# EAGLE design Trail-Traffic-Counter-Board-v10 (EAGLE 8.0.0)

## Sheet 1 of 2
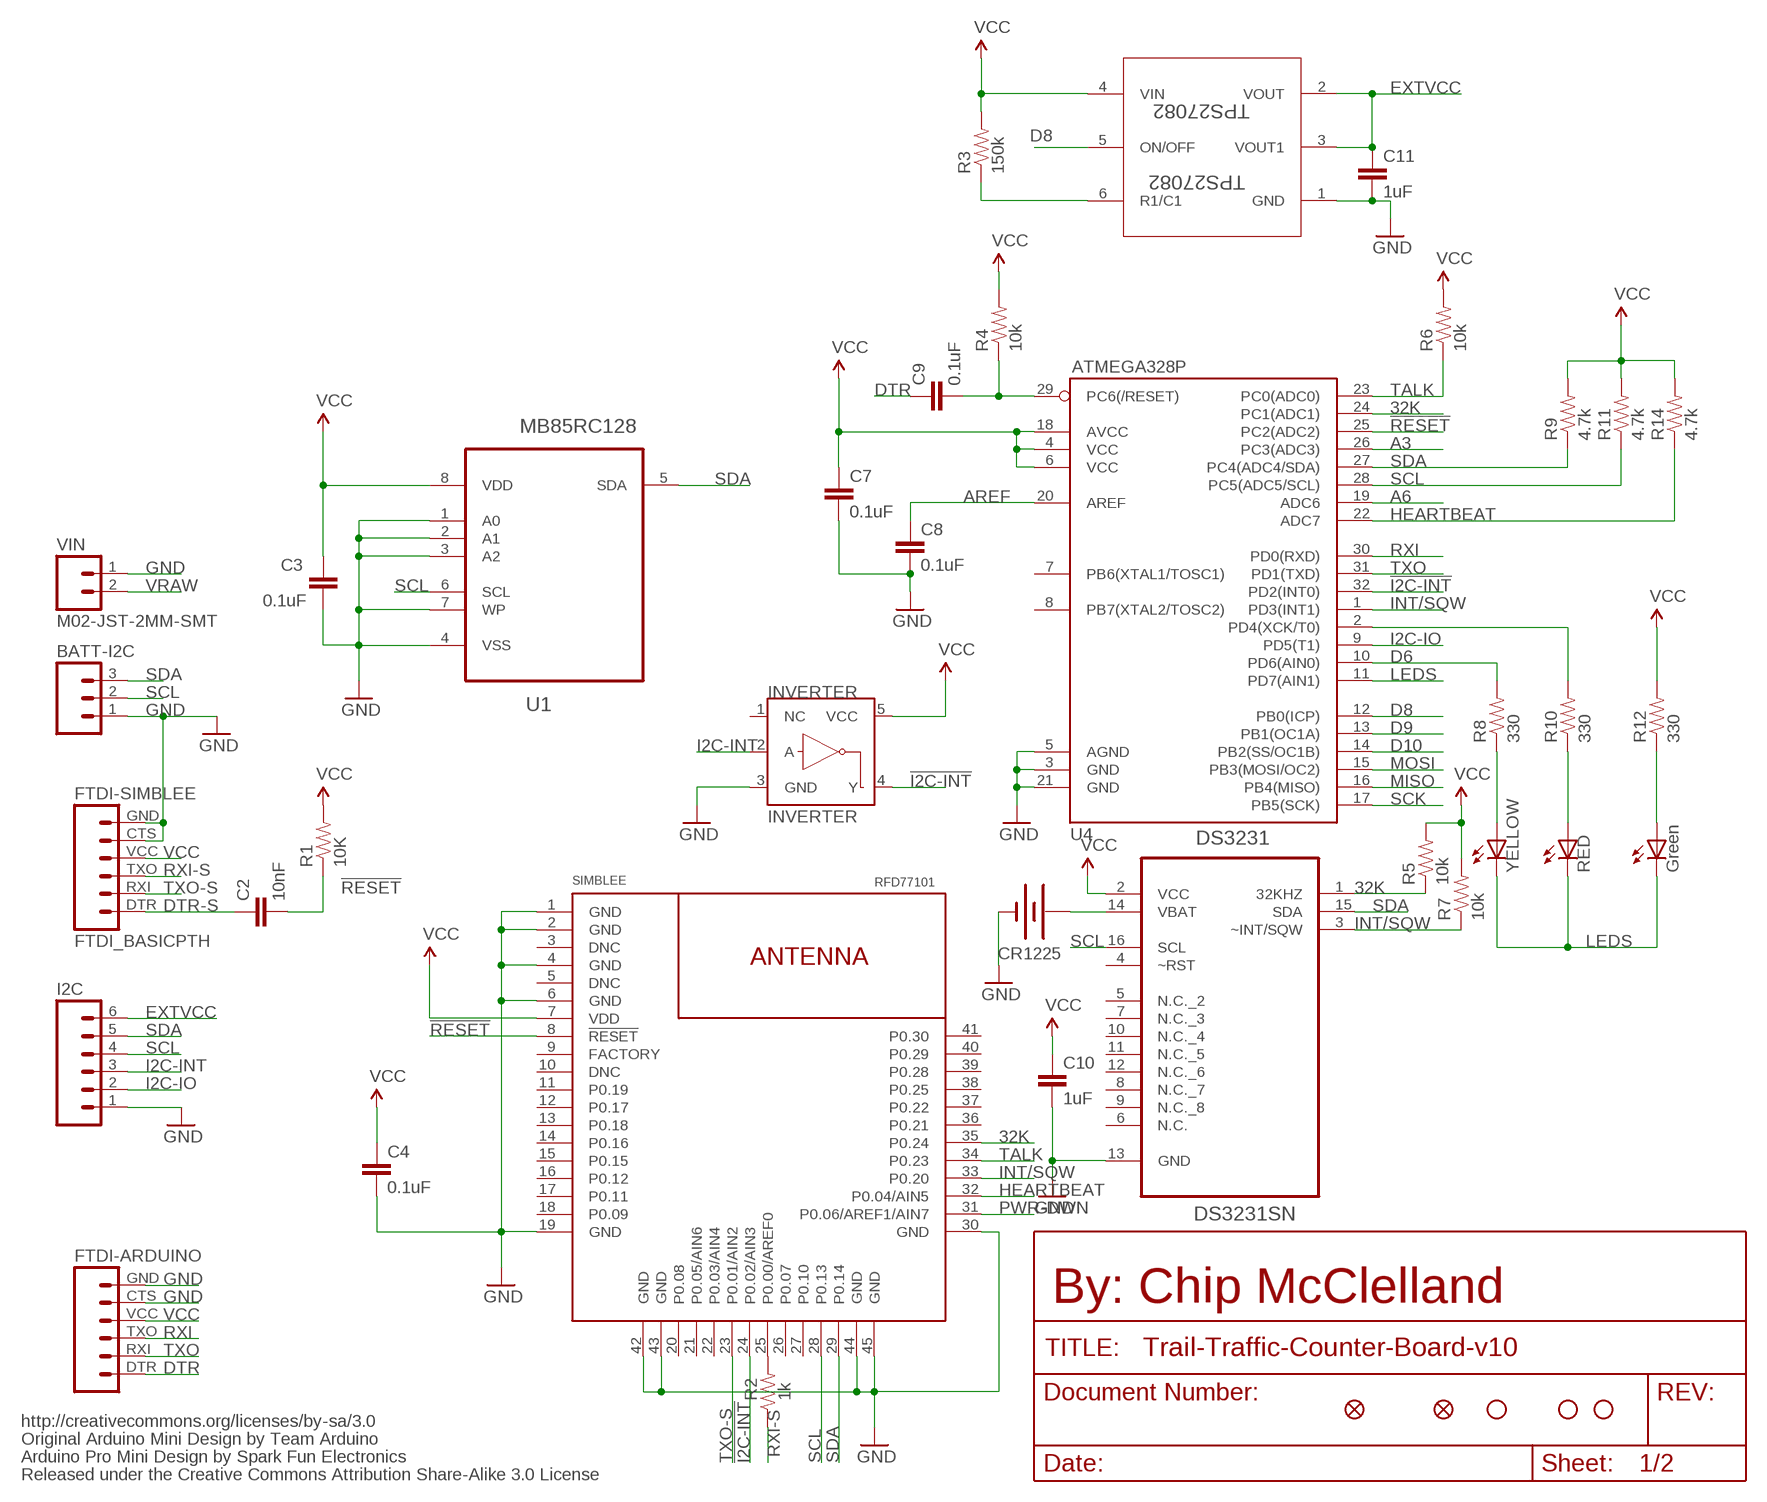
[diagram p0: schematic, sheet 1]

### Parts
ATMEGA328P  U4  ATMEGA168  [TQFP32-08]
BATT-I2C  M03LOCK  [1X03_LOCK]
C2  10nF  CAP0805  [0805]
C3  0.1uF  CAP0805  [0805]
C4  0.1uF  CAP0805  [0805]
C7  0.1uF  CAP0805  [0805]
C8  0.1uF  CAP0805  [0805]
C9  0.1uF  CAP0805  [0805]
C10  1uF  CAP0805  [0805]
C11  1uF  CAP0805  [0805]
CR1225  BATTERY12MM  [BATTCON_12MM]
DS3231  DS3231SN  [SOIC127P1032X265-16N]
FID1  FIDUCIALUFIDUCIAL  [MICRO-FIDUCIAL]
FID2  FIDUCIALUFIDUCIAL  [MICRO-FIDUCIAL]
FTDI-ARDUINO  FTDI Basic  FTDI_BASICPTH  [FTDI_BASIC]
FTDI-SIMBLEE  FTDI_BASICPTH  [FTDI_BASIC]
I2C  M06LOCK  [1X06_LOCK]
INVERTER  INVERTER  [SOT23-5]
JP6  STAND-OFF  [STAND-OFF]
JP7  STAND-OFF  [STAND-OFF]
JP8  STAND-OFF  [STAND-OFF]
LED1  YELLOW  LEDCHIPLED_0805  [CHIPLED_0805]
LED2  RED  LEDCHIPLED_0805  [CHIPLED_0805]
MB85RC128  U1  MB85RC128PNF-G-JNE1  [SOIC127P600X175-8N]
PWR  Green  LEDCHIPLED_0805  [CHIPLED_0805]
R1  10K  RESISTOR0805-RES  [0805]
R2  1k  RESISTOR0805-RES  [0805]
R3  150k  RESISTOR0805-RES  [0805]
R4  10k  RESISTOR0805-RES  [0805]
R5  10k  RESISTOR0805-RES  [0805]
R6  10k  RESISTOR0805-RES  [0805]
R7  10k  RESISTOR0805-RES  [0805]
R8  330  RESISTOR0603  [0603-RES]
R9  4.7k  RESISTOR0805-RES  [0805]
R10  330  RESISTOR0603  [0603-RES]
R11  4.7k  RESISTOR0805-RES  [0805]
R12  330  RESISTOR0603  [0603-RES]
R14  4.7k  RESISTOR0805-RES  [0805]
SIMBLEE  RFD77101  [RFD77101]
TPS27082  TPS27082  [TSOT-23]
VIN  M02-JST-2MM-SMT  [JST-2-SMD]

### Nets
32K: ATMEGA328P.24(PC1(ADC1)) DS3231.1(32KHZ) R5.1 SIMBLEE.35(P0.24)
!I2C-INT: ATMEGA328P.32(PD2(INT0)) INVERTER.4(Y) SIMBLEE.24(P0.02/AIN3)
!RESET: ATMEGA328P.25(PC2(ADC2)) C2.2 R1.1 SIMBLEE.8(!RESET!)
A3: ATMEGA328P.26(PC3(ADC3))
A6: ATMEGA328P.19(ADC6)
AREF: ATMEGA328P.20(AREF) C8.1
D6: ATMEGA328P.10(PD6(AIN0)) R8.2
D8: ATMEGA328P.12(PB0(ICP)) TPS27082.5(ON/OFF)
D9: ATMEGA328P.13(PB1(OC1A))
D10: ATMEGA328P.14(PB2(SS/OC1B))
DTR: C9.1 FTDI-ARDUINO.DTR
DTR-S: C2.1 FTDI-SIMBLEE.DTR
EXTVCC: C11.1 I2C.6 TPS27082.2(VOUT) TPS27082.3(VOUT1)
GND: ATMEGA328P.3(GND) ATMEGA328P.5(AGND) ATMEGA328P.21(GND) BATT-I2C.1 C3.2 C4.2 C7.2 C8.2 C10.2 C11.2 CR1225.GND(-) DS3231.13(GND) FTDI-ARDUINO.CTS FTDI-ARDUINO.GND FTDI-SIMBLEE.CTS FTDI-SIMBLEE.GND I2C.1 INVERTER.3(GND) MB85RC128.1(A0) MB85RC128.2(A1) MB85RC128.3(A2) MB85RC128.4(VSS) MB85RC128.7(WP) SIMBLEE.1(GND) SIMBLEE.2(GND) SIMBLEE.4(GND) SIMBLEE.6(GND) SIMBLEE.19(GND) SIMBLEE.30(GND) SIMBLEE.42(GND) SIMBLEE.43(GND) SIMBLEE.44(GND) SIMBLEE.45(GND) TPS27082.1(GND) VIN.1 ; also sheet 2
HEARTBEAT: ATMEGA328P.22(ADC7) R14.1 SIMBLEE.32(P0.04/AIN5)
I2C-INT: I2C.3 INVERTER.2(A)
I2C-IO: ATMEGA328P.9(PD5(T1)) I2C.2
INT/SQW: ATMEGA328P.1(PD3(INT1)) DS3231.3(~INT/SQW) R7.1 SIMBLEE.33(P0.20)
LEDS: ATMEGA328P.11(PD7(AIN1)) LED1.C LED2.C PWR.C
MISO: ATMEGA328P.16(PB4(MISO))
MOSI: ATMEGA328P.15(PB3(MOSI/OC2))
N$1: LED1.A R8.1
N$3: ATMEGA328P.2(PD4(XCK/T0)) R10.2
N$4: LED2.A R10.1
N$5: R3.1 TPS27082.6(R1/C1)
N$17: R2.2 SIMBLEE.25(P0.00/AREF0)
N$38: PWR.A R12.1
PWR-DWN: SIMBLEE.31(P0.06/AREF1/AIN7) ; also sheet 2
RESET: ATMEGA328P.29(PC6(/RESET)) C9.2 R4.1
RXI: ATMEGA328P.30(PD0(RXD)) FTDI-ARDUINO.TXO
RXI-S: FTDI-SIMBLEE.TXO R2.1
SCK: ATMEGA328P.17(PB5(SCK))
SCL: ATMEGA328P.28(PC5(ADC5/SCL)) BATT-I2C.2 DS3231.16(SCL) I2C.4 MB85RC128.6(SCL) R11.1 SIMBLEE.28(P0.13)
SDA: ATMEGA328P.27(PC4(ADC4/SDA)) BATT-I2C.3 DS3231.15(SDA) I2C.5 MB85RC128.5(SDA) R9.1 SIMBLEE.29(P0.14)
TALK: ATMEGA328P.23(PC0(ADC0)) R6.1 SIMBLEE.34(P0.23)
TXO: ATMEGA328P.31(PD1(TXD)) FTDI-ARDUINO.RXI
TXO-S: FTDI-SIMBLEE.RXI SIMBLEE.23(P0.01/AIN2)
VBAT: CR1225.PWR@1(+) DS3231.14(VBAT)
VCC: ATMEGA328P.4(VCC) ATMEGA328P.6(VCC) ATMEGA328P.18(AVCC) C3.1 C4.1 C7.1 C10.1 DS3231.2(VCC) FTDI-ARDUINO.VCC FTDI-SIMBLEE.VCC INVERTER.5(VCC) MB85RC128.8(VDD) R1.2 R3.2 R4.2 R5.2 R6.2 R7.2 R9.2 R11.2 R12.2 R14.2 SIMBLEE.7(VDD) TPS27082.4(VIN) ; also sheet 2
VRAW: VIN.2 ; also sheet 2
Unconnected: ATMEGA328P.7(PB6(XTAL1/TOSC1)) ATMEGA328P.8(PB7(XTAL2/TOSC2)) DS3231.4(~RST) DS3231.5(N.C._2) DS3231.6(N.C.) DS3231.7(N.C._3) DS3231.8(N.C._7) DS3231.9(N.C._8) DS3231.10(N.C._4) DS3231.11(N.C._5) DS3231.12(N.C._6) INVERTER.1(NC) SIMBLEE.3(DNC) SIMBLEE.5(DNC) SIMBLEE.9(FACTORY) SIMBLEE.10(DNC) SIMBLEE.11(P0.19) SIMBLEE.12(P0.17) SIMBLEE.13(P0.18) SIMBLEE.14(P0.16) SIMBLEE.15(P0.15) SIMBLEE.16(P0.12) SIMBLEE.17(P0.11) SIMBLEE.18(P0.09) SIMBLEE.20(P0.08) SIMBLEE.21(P0.05/AIN6) SIMBLEE.22(P0.03/AIN4) SIMBLEE.26(P0.07) SIMBLEE.27(P0.10) SIMBLEE.36(P0.21) SIMBLEE.37(P0.22) SIMBLEE.38(P0.25) SIMBLEE.39(P0.28) SIMBLEE.40(P0.29) SIMBLEE.41(P0.30)

### Notes on the sheet
- By: Chip McClelland
- http://creativecommons.org/licenses/by-sa/3.0
- Original Arduino Mini Design by Team Arduino
- Arduino Pro Mini Design by Spark Fun Electronics
- Released under the Creative Commons Attribution Share-Alike 3.0 License

## Sheet 2 of 2
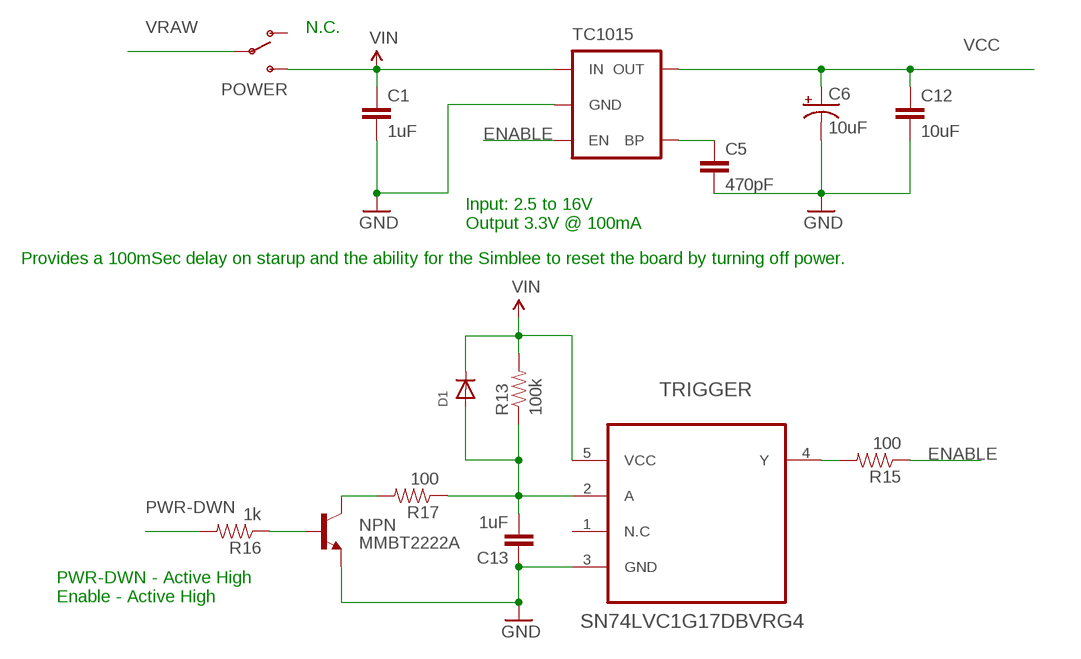
[diagram p1: schematic, sheet 2]

### Parts
C1  1uF  CAP0805  [0805]
C5  470pF  CAP0805  [0805]
C6  10uF  CAP_POL1206  [EIA3216]
C12  10uF  CAP0805  [0805]
C13  1uF  CAP0805  [0805]
D1  DIODESOD-523  [SOD-523]
NPN  MMBT2222A  TRANSISTOR_NPNMMBT2222A  [SOT23-3]
POWER  SWITCH-SPDTPTH  [SWITCH-SPDT]
R13  100k  RESISTOR0805-RES  [0805]
R15  100  RESISTOR0805-RES  [0805]
R16  1k  RESISTOR0805-RES  [0805]
R17  100  RESISTOR0805-RES  [0805]
TC1015  MIC52053.3V  [SOT23-5]
TRIGGER  SN74LVC1G17DBVRG4  [SOT95P280X145-5N]

### Nets
ENABLE: R15.1 TC1015.3(EN)
GND: C1.2 C5.2 C6.C(-) C12.2 C13.1 NPN.2(E) TC1015.2(GND) TRIGGER.3(GND) ; also sheet 1
N$2: C5.1 TC1015.4(BP)
N$6: C13.2 D1.A R13.1 R17.1 TRIGGER.2(A)
N$14: R15.2 TRIGGER.4(Y)
N$15: NPN.1(B) R16.1
N$16: NPN.3(C) R17.2
PWR-DWN: R16.2 ; also sheet 1
VCC: C6.A(+) C12.1 TC1015.5(OUT) ; also sheet 1
VIN: C1.1 D1.K(C) POWER.3(S) R13.2 TC1015.1(IN) TRIGGER.5(VCC)
VRAW: POWER.2(P) ; also sheet 1
Unconnected: POWER.1(O) TRIGGER.1(N.C)

### Notes on the sheet
- N.C.
- Input: 2.5 to 16V
  Output 3.3V @ 100mA
- Provides a 100mSec delay on starup and the ability for the Simblee to reset the board by turning off power.
- PWR-DWN - Active High
  Enable - Active High

## Library data of the parts
ATMEGA328P = SparkFun:ATMEGA168
BATT-I2C = SparkFun-Connectors:M03: Header 3 Standard 3-pin 0.1" header. Use with straight break away headers (SKU : PRT-00116), right angle break away headers (PRT-00553), swiss pins (PRT-00743), machine pins (PRT-00117), and female headers (PRT-00115). Molex polarized connector foot print use with SKU : PRT-08232 with associated crimp pins and housings.
C1 C2 C5 C12 = SparkFun-Passives:CAP: Capacitor Standard 0603 ceramic capacitor, and 0.1" leaded capacitor.
C3 C4 C7-C11 C13 = SparkFun-Capacitors:CAP: Capacitor Standard 0603 ceramic capacitor, and 0.1" leaded capacitor.
C6 = SparkFun-Capacitors:CAP_POL: Capacitor Polarized These are standard SMD and PTH capacitors. Normally 10uF, 47uF, and 100uF in electrolytic and tantalum varieties. Always verify the external diameter of the through hole cap, it varies with capacity, voltage, and manufacturer. The EIA devices should be standard.
CR1225 = SparkFun-Electromechanical:BATTERY: Battery Holders Various common sizes : AA, AAA, 20mm coin cell and 12mm coin cell. 20MM_4LEGS, BATT-10373
D1 = adafruit:DIODE: Diode SMADIODE - SMA Surface Mount Package 20V 1A Schottky Diode Digikey: 641-1014-6-ND DO-1N4148 - Through Hole Small Current Diode SOD-123 20V 1 A (.5mV Vf) Schottky Diode - Digikey: MBRX120TPMSCT-ND SOD-323 10V 570mA (.38mV Vf, 3ns) Schottky Diode - Digikey: ZLLS410CT-ND SOD-523 30V 30mA Schottky Diode (RB751S-40TE61) - Digikey: RB751S-40TE61CT-ND SOT23-R/W - SOT23 Package (R = Solder Paste/Reflow Ovens, W = Hand-Soldering) BAT54Film 40V 300mA - Digikey: 497-7162-1-ND
DS3231 = Maxim_By_element14_Batch_1:DS3231SN: Extremely Accurate I2C-Integrated RTC/TCXO/Crystal; MPN: DS3231SN#; OC_FARNELL: 1593292; OC_NEWARK: 68K3406; PACKAGE: SOIC-16; SUPPLIER: Maxim
FID1 FID2 = SparkFun-Aesthetics:FIDUCIAL: Fiducial Alignment Points Various fiducial points for machine vision alignment.
FTDI-ARDUINO FTDI-SIMBLEE = SparkFun-Connectors:FTDI_BASIC: FTDI Basic header with labels
I2C = SparkFun-Connectors:M06: Header 6 Standard 6-pin 0.1" header. Use with straight break away headers (SKU : PRT-00116), right angle break away headers (PRT-00553), swiss pins (PRT-00743), machine pins (PRT-00117), and female headers (PRT-00115). Molex polarized connector foot print use with SKU : PRT-08094 with associated crimp pins and housings. NOTES ON THE VARIANTS LOCK and LOCK_LONGPADS... This footprint was designed to help hold the alignment of a through-hole component (i.e. 6-pin header) while soldering it into place. You may notice that each hole has been shifted either up or down by 0.005 of an inch from it's more standard position (which is a perfectly straight line). This slight alteration caused the pins (the squares in the middle) to touch the edges of the holes. Because they are alternating, it causes a "brace" to hold the component in place. 0.005 has proven to be the perfect amount of "off-center" position when using our standard breakaway headers. Although looks a little odd when you look at the bare footprint, once you have a header in there, the alteration is very hard to notice. Also,if you push a header all the way into place, it is covered up entirely on the bottom side. This idea of altering the position of holes to aid alignment will be further integrated into the Sparkfun Library for other footprints. It can help hold any component with 3 or more connection pins.
INVERTER = SparkFun-DigitalIC:INVERTER: Single inverter, SOT23-5
JP6-JP8 = SparkFun:STAND-OFF: Stand Off This is the mechanical footprint for a #4 phillips button head screw. Use the keepout ring to avoid running the screw head into surrounding components. SKU : PRT-00447
LED1 LED2 PWR = adafruit:LED: LED OSRAM: - CHIPLED LG R971, LG N971, LY N971, LG Q971, LY Q971, LO R971, LY R971 LH N974, LH R974 LS Q976, LO Q976, LY Q976 LO Q996 - Hyper CHIPLED LW Q18S LB Q993, LB Q99A, LB R99A - SideLED LS A670, LO A670, LY A670, LG A670, LP A670 LB A673, LV A673, LT A673, LW A673 LH A674 LY A675 LS A676, LA A676, LO A676, LY A676, LW A676 LS A679, LY A679, LG A679 - Hyper Micro SIDELED® LS Y876, LA Y876, LO Y876, LY Y876 LT Y87S - SmartLED LW L88C, LW L88S LB L89C, LB L89S, LG L890 LS L89K, LO L89K, LY L89K LS L896, LA L896, LO L896, LY L896 - TOPLED LS T670, LO T670, LY T670, LG T670, LP T670 LSG T670, LSP T670, LSY T670, LOP T670, LYG T670 LG T671, LOG T671, LSG T671 LB T673, LV T673, LT T673, LW T673 LH T674 LS T676, LA T676, LO T676, LY T676, LB T676, LH T676, LSB T676, LW T676 LB T67C, LV T67C, LT T67C, LS T67K, LO T67K, LY T67K, LW E67C LS E67B, LA E67B, LO E67B, LY E67B, LB E67C, LV E67C, LT E67C LW T67C LS T679, LY T679, LG T679 LS T770, LO T770, LY T770, LG T770, LP T770 LB T773, LV T773, LT T773, LW T773 LH T774 LS E675, LA E675, LY E675, LS T675 LS T776, LA T776, LO T776, LY T776, LB T776 LHGB T686 LT T68C, LB T68C - Hyper Mini TOPLED® LB M676 - Mini TOPLED Santana® LG M470 LS M47K, LO M47K, LY M47K Source: http://www.osram.convergy.de/
MB85RC128 = Fujitsu_By_element14_Batch_1:MB85RC128PNF-G-JNE1: Memory FRAM; MPN: MB85RC128PNF-G-JNE1; OC_FARNELL: 1831995; OC_NEWARK: 93R5161; PACKAGE: SO-8; SUPPLIER: FUJITSU
NPN = SparkFun-DiscreteSemi:TRANSISTOR_NPN: Generic NPN BJT MMBT2222A - TRANS-08049 (SOT-23, 1A 40V) MPSA42 - TRANS-09116 (SOT-23, 500mA 300V) MMBT5088LT1G - TRANS-11160 (SOT-23, 50 mA 30V); PROD_ID: TRANS-08049
POWER = SparkFun-Electromechanical:SWITCH-SPDT: SPDT Switch Simple slide switch, Spark Fun Electronics SKU : COM-00102 DPDT SMT slide switch, AYZ0202, SWCH-08179
R1-R7 R13 R15-R17 = SparkFun-Passives:RESISTOR: Resistor Basic schematic elements and footprints for 0603, 1206, and PTH resistors.
R8-R12 R14 = SparkFun-Resistors:RESISTOR: Resistor Basic schematic elements and footprints for 0603, 1206, and PTH resistors.
SIMBLEE = RFDigital:RFD77101: Simblee ™ BLE Module RFD77101 © 2015 RF Digital Corporation www.RFDigital.com www.Simblee.com PATENTS PENDING 04.01.2015
TC1015 = SparkFun-PowerIC:MIC5205: MIC5205 150mA vreg 3.3V - VREG-00822 5V - VREG-00823; PROD_ID: VREG-00822
TPS27082 = Custom Components:TPS27082: TI TPS27082 Single High-Side On-Off Switch
TRIGGER = Texas Instruments_By_element14_Batch_1:SN74LVC1G17DBVRG4: SINGLE SCHMITT-TRIGGER BUFFER; MPN: SN74LVC1G17DBVRG4; OC_FARNELL: 1287608; OC_NEWARK: 26M3320; PACKAGE: SOT-23-5; SUPPLIER: Texas Instruments
VIN = SparkFun-Connectors:M02: Standard 2-pin 0.1" header. Use with - straight break away headers ( PRT-00116) - right angle break away headers (PRT-00553) - swiss pins (PRT-00743) - machine pins (PRT-00117) - female headers (PRT-00115) Molex polarized connector foot print use with: PRT-08233 with associated crimp pins and housings. 2.54_SCREWTERM for use with PRT-10571. 3.5mm Screw Terminal footprints for PRT-08084 5mm Screw Terminal footprints for use with PRT-08433; PROD_ID: CONN-08352

## Net classes
0 default: width 0.203 mm, drill 0.33 mm
1 vcc: width 0.254 mm

## Board
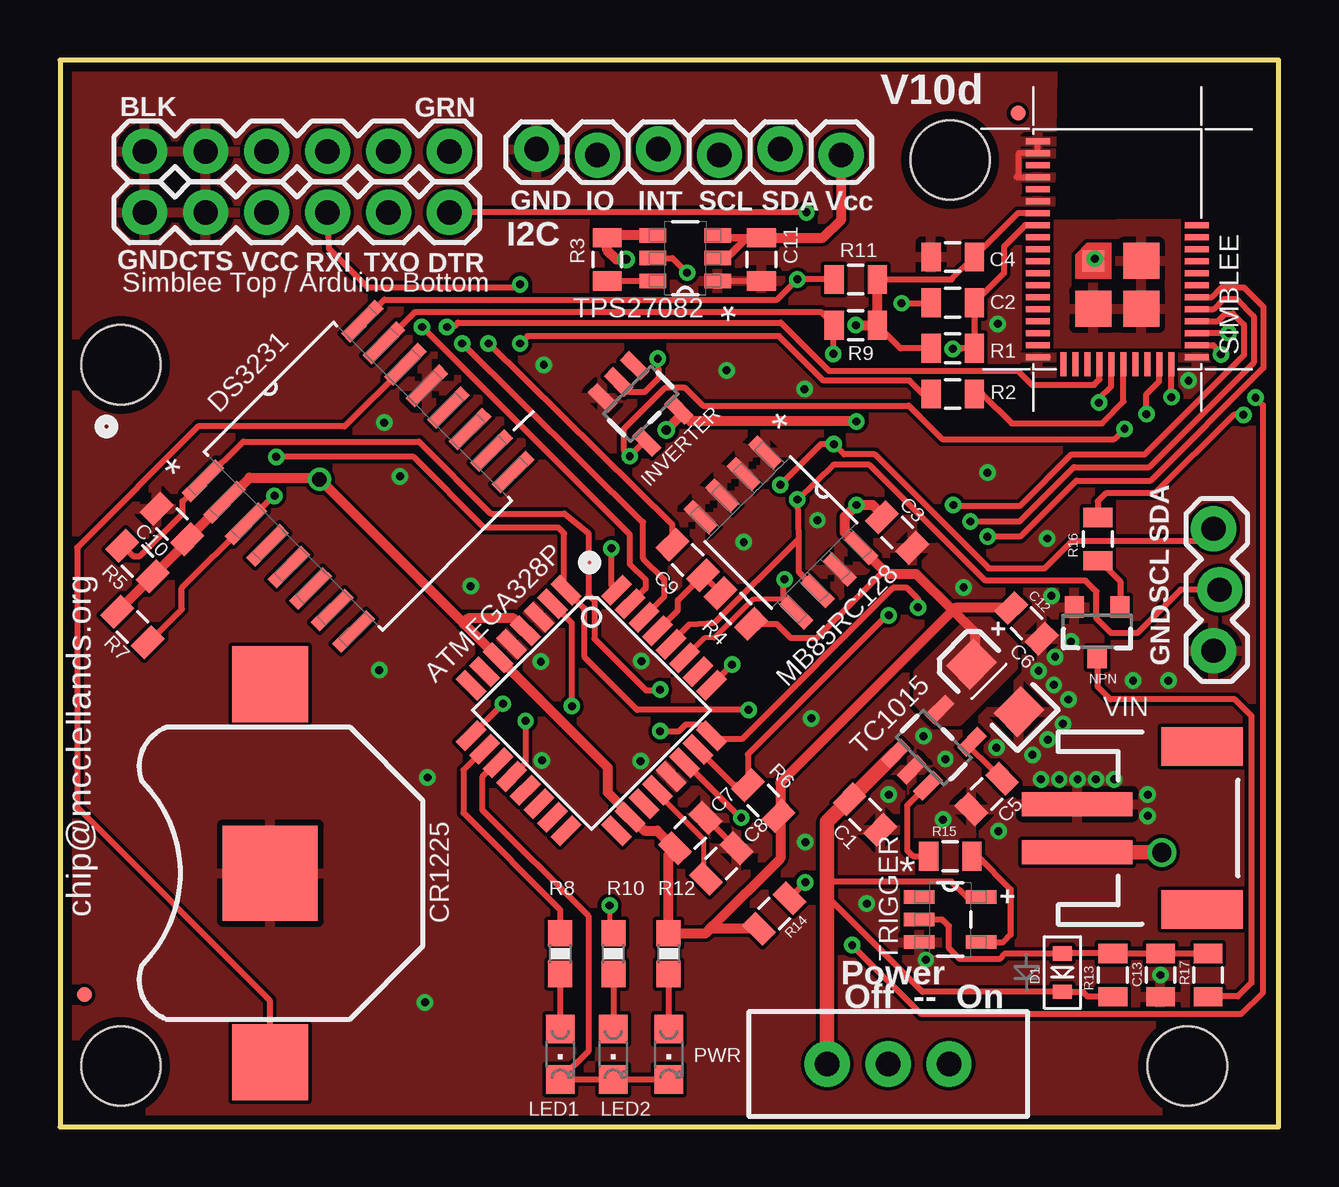
[diagram p2: board, top side]
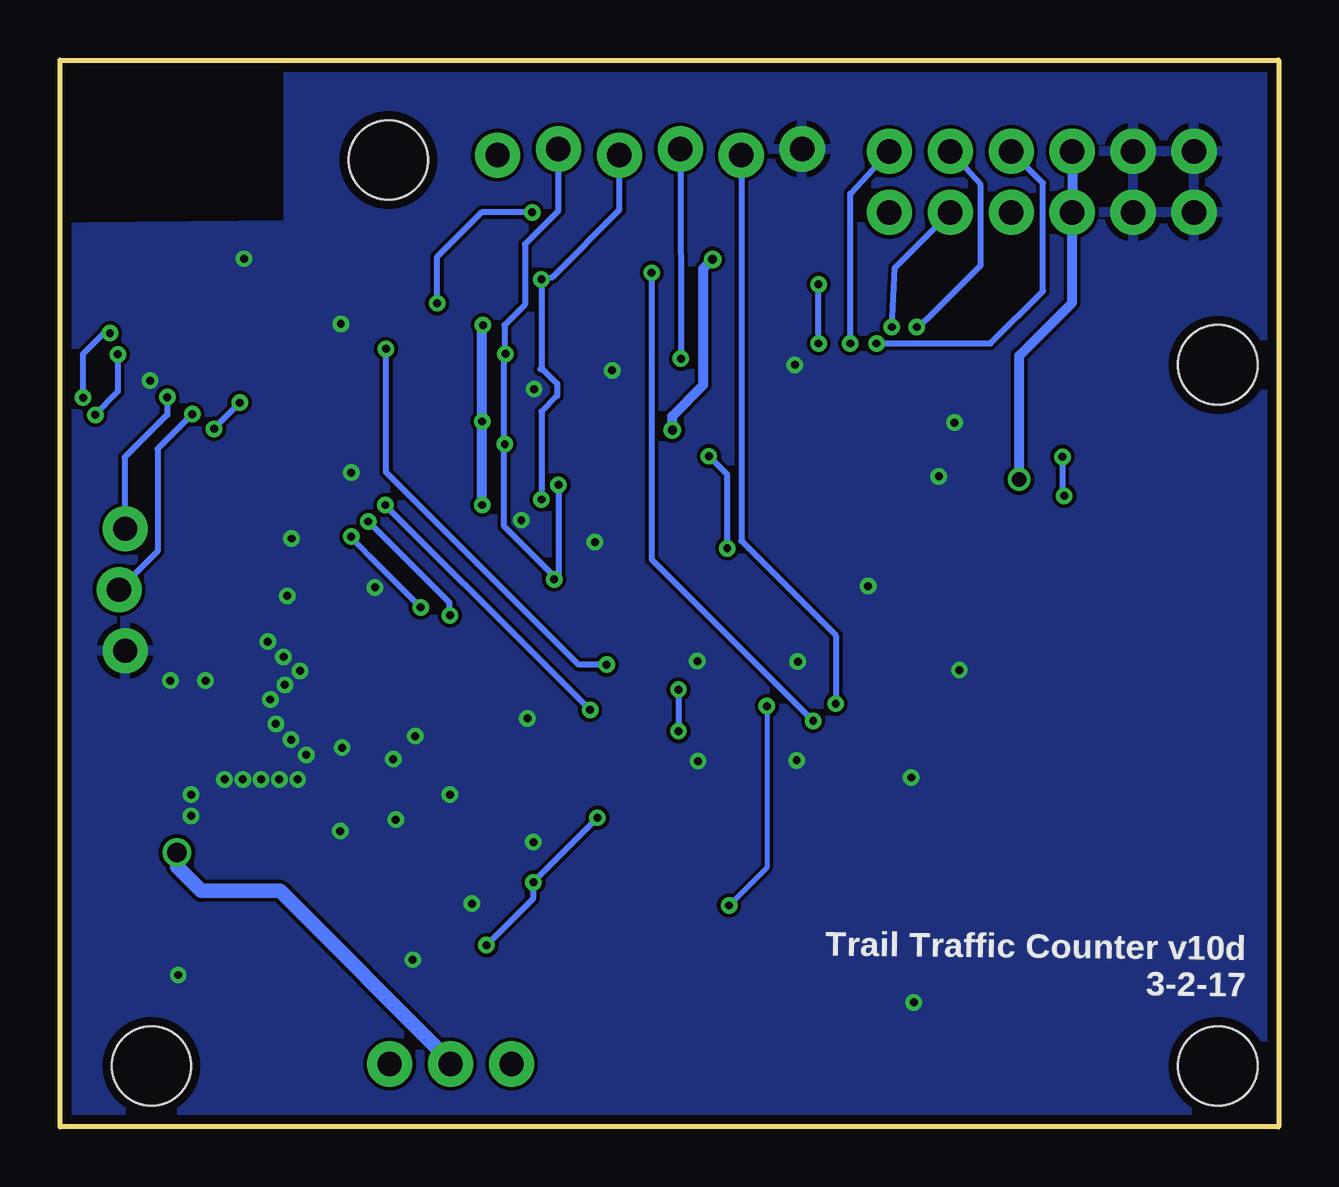
[diagram p3: board, bottom side, seen from below]

Size 50.8 x 44.45 mm. Coordinates in mm from the lower left corner, seen from the top.
Outline: 0,44.45 0,0 50.8,0 50.8,44.45 0,44.45
Copper layers (1*16): Top 0.0356mm / dielectric 1.5011mm / Bottom 0.0356mm
Design rules "LaenPCBOrder": minimum track width 6mil, minimum drill 13mil, track to track 6mil, track to pad 6mil, pad to pad 6mil, via to via 6mil, smd to smd 6mil, copper to edge 15mil, drill to drill 6mil, minimum pad ring 7mil, minimum via ring 7mil, stop-mask expansion 3mil, vias tented up to drill 0mil, thermal gap 10mil

### Footprints (pad centres in the part's own frame; a part is rotated, then mirrored left to right if it is on the bottom)
TQFP32-08 = smd 1.27 x 0.559: 1 -4.293,2.8; 2 -4.293,2; 3 -4.293,1.2; 4 -4.293,0.4; 5 -4.293,-0.4; 6 -4.293,-1.2; 7 -4.293,-2; 8 -4.293,-2.8; 17 4.293,-2.8; 18 4.293,-2; 19 4.293,-1.2; 20 4.293,-0.4; 21 4.293,0.4; 22 4.293,1.2; 23 4.293,2; 24 4.293,2.8 | smd 0.559 x 1.27: 9 -2.8,-4.293; 10 -2,-4.293; 11 -1.2,-4.293; 12 -0.4,-4.293; 13 0.4,-4.293; 14 1.2,-4.293; 15 2,-4.293; 16 2.8,-4.293; 25 2.8,4.293; 26 2,4.293; 27 1.2,4.293; 28 0.4,4.293; 29 -0.4,4.293; 30 -1.2,4.293; 31 -2,4.293; 32 -2.8,4.293
1X03_LOCK = drill 1.016 pad 1.88: 1 0,0.127; 2 2.54,-0.127; 3 5.08,0.127
0805 = smd 0.8 x 1.2: 1 -0.9,0; 2 0.9,0
EIA3216 = smd 1.4 x 1.6: A 1.4,0; C -1.4,0
BATTCON_12MM = smd 3.962 x 3.962: GND 0,0 | smd 3.175 x 3.175: PWR@1 -7.874,0; PWR@2 7.874,0
SOD-523 = smd 0.8 x 0.6: A 0,-0.8; K 0,0.8
SOIC127P1032X265-16N = smd 1.981 x 0.533: 1 -4.699,4.445; 2 -4.699,3.175; 3 -4.699,1.905; 4 -4.699,0.635; 5 -4.699,-0.635; 6 -4.699,-1.905; 7 -4.699,-3.175; 8 -4.699,-4.445; 9 4.699,-4.445; 10 4.699,-3.175; 11 4.699,-1.905; 12 4.699,-0.635; 13 4.699,0.635; 14 4.699,1.905; 15 4.699,3.175; 16 4.699,4.445
MICRO-FIDUCIAL = smd 0.635 x 0.635: 1 0,0
FTDI_BASIC = drill 1.016 pad 1.88: CTS 10.16,0; DTR 0,0; GND 12.7,0; RXI 2.54,0; TXO 5.08,0; VCC 7.62,0
1X06_LOCK = drill 1.016 pad 1.88: 1 0,0; 2 2.54,-0.254; 3 5.08,0; 4 7.62,-0.254; 5 10.16,0; 6 12.7,-0.254
SOT23-5 = smd 0.55 x 1.2: 1 -0.95,-1.3; 2 0,-1.3; 3 0.95,-1.3; 4 0.95,1.3; 5 -0.95,1.3
STAND-OFF = hole 3.302: 0,0
CHIPLED_0805 = smd 1.2 x 1.2: A 0,-1.05; C 0,1.05
SOIC127P600X175-8N = smd 1.473 x 0.559: 1 -2.819,1.905; 2 -2.819,0.635; 3 -2.819,-0.635; 4 -2.819,-1.905; 5 2.819,-1.905; 6 2.819,-0.635; 7 2.819,0.635; 8 2.819,1.905
SOT23-3 = smd 0.8 x 0.9: 1 -0.95,-1; 2 0.95,-1; 3 0,1.1
SWITCH-SPDT = drill 1.016 pad 1.88: 1 0,2.54; 2 0,0; 3 0,-2.54
0603-RES = smd 1.1 x 1: 1 -0.85,0; 2 0.85,0
RFD77101 = smd 1 x 0.254: 1 0,0; 2 0,-0.5; 3 0,-1; 4 0,-1.5; 5 0,-2; 6 0,-2.5; 7 0,-3; 8 0,-3.5; 9 0,-4; 10 0,-4.5; 11 0,-5; 12 0,-5.5; 13 0,-6; 14 0,-6.5; 15 0,-7; 16 0,-7.5; 17 0,-8; 18 0,-8.5; 19 0,-9; 30 6.61,-9; 31 6.61,-8.5; 32 6.61,-8; 33 6.61,-7.5; 34 6.61,-7; 35 6.61,-6.5; 36 6.61,-6; 37 6.61,-5.5; 38 6.61,-5; 39 6.61,-4.5; 40 6.61,-4; 41 6.61,-3.5 | smd 0.254 x 1: 20 1.055,-9.29; 21 1.555,-9.29; 22 2.055,-9.29; 23 2.555,-9.29; 24 3.055,-9.29; 25 3.555,-9.29; 26 4.055,-9.29; 27 4.555,-9.29; 28 5.055,-9.29; 29 5.555,-9.29 | smd 0.9 x 0.9: 42 2.3,-4.99 | smd 1.5 x 1.5: 43 2.3,-6.99; 44 4.3,-6.99; 45 4.3,-4.99
TSOT-23 = smd 1.1 x 0.6: 1 -1.35,0.95; 2 -1.35,0; 3 -1.35,-0.94; 4 1.35,-0.95; 5 1.35,0; 6 1.35,0.95
SOT95P280X145-5N = smd 1.27 x 0.559: 1 -1.295,0.94; 2 -1.295,0; 3 -1.295,-0.94; 4 1.295,-0.94; 5 1.295,0.94
JST-2-SMD = smd 1 x 4.6: 1 -1,-3.7; 2 1,-3.7 | smd 1.6 x 3.4: NC1 -3.4,1.5; NC2 3.4,1.5

### Placement (x,y rotation side)
ATMEGA328P  22.15,17.35 315 top
BATT-I2C  48.21,19.84 90 top
C1  33.55,13 315 top
C2  37.21,34.34 0 top
C3  34.9,24.77 315 top
C4  37.21,36.25 180 top
C5  38.63,13.87 225 top
C6  38.99,18.29 135 top
C7  26.26,12.24 45 top
C8  27.56,10.97 45 top
C9  26.16,23.62 315 top
C10  4.67,25.12 135 top
C11  29.24,36.14 270 top
C12  40.28,20.98 315 top
C13  45.87,6.32 90 top
CR1225  8.76,10.57 90 top
D1  41.78,6.43 180 top
DS3231  12.42,27.1 45 top
FID1  1.02,5.51 0 top
FID2  39.93,42.24 0 top
FTDI-ARDUINO  16.23,40.64 180 top
FTDI-SIMBLEE  16.23,38.1 180 top
I2C  19.86,40.74 0 top
INVERTER  24.21,30.12 225 top
JP2  STAND-OFF  [STAND-OFF]  2.54,31.75 0 top
JP6  46.99,2.54 0 top
JP7  2.54,2.54 0 top
JP8  37.11,40.28 0 top
LED1  20.85,3.02 180 top
LED2  23.06,3.02 180 top
MB85RC128  30.05,24.77 315 top
NPN  43.23,20.65 180 top
POWER  34.52,2.62 270 top
PWR  25.37,3.02 180 top
R1  37.21,32.44 180 top
R2  37.21,30.53 0 top
R3  22.81,36.14 90 top
R4  28.17,21.59 315 top
R5  3.23,23.57 315 top
R6  29.31,13.59 315 top
R7  3.02,20.83 135 top
R8  20.85,7.21 90 top
R9  33.17,33.4 0 top
R10  23.06,7.21 90 top
R11  33.17,35.31 0 top
R12  25.37,7.21 90 top
R13  43.89,6.32 270 top
R14  29.77,8.89 225 top
R15  37.11,11.28 0 top
R16  43.26,24.49 90 top
R17  47.85,6.32 270 top
SIMBLEE  40.77,41.07 0 top
TC1015  36.42,15.8 315 top
TPS27082  26.06,36.2 180 top
TRIGGER  37.11,8.64 0 top
VIN  46.1,12.45 270 top

### Tracks (layer width: path | path; a pad name or v marks a point on that pad's centre or on a via)
32K  (via drill 0.33)
  Top 0.254: v38.66,24.59 40.03,24.59 42.37,26.92 45.47,26.92 50.16,31.62 50.16,34.16 49.35,34.98 48.41,34.98 48.01,34.57 SIMBLEE.35 | v35.76,21.64 35.76,22 35.31,22.45 34.72,22.45 28.42,16.15 27.3,16.15 ATMEGA328P.24 26.69,16.76 26.09,16.76 25.81,16.48 v25.02,16.48 | R5.1 2.62,24.21 3.05,23.77 3.33,23.77 5.11,25.55 5.11,26.07 DS3231.1 5.99,26.92 7.64,28.55 14.96,28.55 17.96,25.55 21.03,25.55 22.02,24.74 22.02,22.17 22.28,21.92 22.28,20.34 24.43,18.19 24.99,18.19 v25.02,18.21
  Bottom 0.254: v38.66,24.59 37.9,23.77 v35.76,21.64 | v25.02,18.21 v25.02,16.48
!I2C-INT  (via drill 0.33)
  Top 0.254: v44.37,29.08 43.94,28.65 36.78,28.65 35.38,30.05 26.8,30.05 26.06,30.79 25.22,30.79 23.5,29.06 23.5,28.19 v23.75,27.94 24.34,28.53 INVERTER.4 | v43.31,30.18 43.31,30.33 43.81,30.84 SIMBLEE.24 | v22.99,24.11 22.99,22.58 ATMEGA328P.32
  Bottom 0.254: v44.37,29.08 44.37,29.11 v43.31,30.18 | v22.99,24.11 22.99,27.18 v23.75,27.94
!RESET  (via drill 0.33 pad 0.25)
  Top 0.254: SIMBLEE.8 40.24,37.57 39.34,36.68 39.34,35.57 C2.2 R1.1 37.59,32.44 37.24,32.44 | 37.24,32.44 v37.21,32.41 37.21,32.44 37.24,32.44 | ATMEGA328P.25 v28.02,19.25
  Bottom 0.254: v28.02,19.25 29.18,19.25 37.21,27.28 v37.21,32.41
AREF
  Top 0.203: C8.1 26.82,10.39 26.82,11.99 24.87,13.95 ATMEGA328P.20
D6
  Top 0.203: 20.7,8.1 R8.2
  Top 0.254: ATMEGA328P.10 17.68,15.73 16.82,14.86 16.82,13.08 20.85,9.04 R8.2
D8  (via drill 0.33)
  Top 0.254: TPS27082.5 25.53,36.2 v26.14,35.59 | v19.41,16.92 19.41,15.17 ATMEGA328P.12
  Bottom 0.254: v26.14,35.59 26.14,23.65 v19.41,16.92
DTR  (via drill 0.33)
  Top 0.254: C9.1 25.53,25.09 v17.86,32.64
  Bottom 0.254: v17.86,32.64 17.86,38.89 FTDI-ARDUINO.DTR
DTR-S  (via drill 0.33)
  Top 0.254: v35.08,34.31 36.29,34.31 C2.1 | v31.11,38.1 FTDI-SIMBLEE.DTR
  Bottom 0.254: v35.08,34.31 35.08,36.25 33.22,38.1 v31.11,38.1
ENABLE
  Top 0.254: TC1015.3 36.13,14.21 35.31,13.39 35.31,11.53 35.56,11.28 R15.1
EXTVCC
  Top 0.254: 27.5,37.04 TPS27082.3 | TPS27082.2 27.78,36.2
  Top 0.305: C11.1 28.63,37.04 | 28.63,37.04 27.5,37.04 | 27.78,36.2 28.63,37.04
  Top 0.406: C11.1 31.81,37.04 32.56,37.8 I2C.6
GND  (via drill 0.33)
  Top 0.254: SIMBLEE.1 SIMBLEE.2 39.99,40.57 39.95,40.54 39.95,39.65 39.88,39.57 SIMBLEE.4 | SIMBLEE.44 | SIMBLEE.19 41.19,32.07 | 43.05,34.07 SIMBLEE.43 | TPS27082.1 C11.2 | C7.2 26.93,12.88 C8.2
  other vias: 13.31,19.02 17.12,22.53 14.17,27.1 31.06,11.86 20.04,19.38 20.09,15.27 24.21,15.24 24.23,19.41 31.32,17.02 47.04,31.09 28.5,24.36 39.09,33.45 43.13,36.17 15.32,14.55 38.66,27.25 27.79,31.52 13.51,29.34 15.21,5.18 31.57,25.27 20.17,31.75 31.04,30.73 35.99,16.28 36.91,15.32 34.54,13.84 36.8,12.8 39.12,12.32 41.43,18.41 41.81,16.79 40.54,15.49 42.04,17.81 41.15,24.51 41.33,22.12 42.14,20.22 41.48,19.58 40.79,19 41.17,16.13 39.04,15.8 40.89,14.48 41.66,14.48 42.42,14.48 43.18,14.48 43.94,14.48 45.34,13.84 45.34,12.95 46.2,18.59 44.73,18.59 33.63,9.3 36.09,6.96 45.87,6.32 37.67,22.48
  pour Bottom: 3.66,45.34 -1.4,45.44 -1.22,-5.26 52.68,-7.98 52.68,33.02 51.82,35.66 51.84,37.49 41.27,37.59 41.27,45.06
  pour Top (rank 2): -1.35,45.47 -1.5,-5.23 52.17,-5.18 52.35,37.67 41.27,37.59 41.4,45.19
HEARTBEAT  (via drill 0.33, 0.33 pad 0.3)
  Top 0.254: ATMEGA328P.22 26.06,15.16 28.4,12.83 v28.4,12.88 | v31.06,10.19 R14.1 | v49.84,30.38 50.14,30.07 50.14,5.59 49.23,4.7 35.92,4.7 v33.02,7.57 | v48.72,33.07 SIMBLEE.32
  Bottom 0.254: v28.4,12.88 31.09,10.19 | 31.09,10.19 v31.06,10.19 | v49.84,30.38 49.84,32.21 48.97,33.07 v48.72,33.07 | 31.09,10.19 31.09,9.5 v33.02,7.57 33.07,7.52
I2C-INT  (via drill 0.33)
  Top 0.254: v24.92,32 24.94,31.19 24.36,30.61 23.72,30.61 INVERTER.2
  Bottom 0.254: I2C.3 v24.92,32
I2C-IO  (via drill 0.33 pad 0.33)
  Top 0.254: v18.47,17.63 v18.47,17.62 ATMEGA328P.9
  Bottom 0.254: I2C.2 22.4,24.41 18.47,20.47 v18.47,17.63
INT/SQW  (via drill 0.33, 0.33 pad 0.33)
  Top 0.203: ATMEGA328P.1 21.02,22.36
  Top 0.254: v37.24,25.91 37.29,25.86 40.01,25.86 42.16,28.02 45.21,28.02 49.35,32.16 49.35,33.43 48.9,33.88 48.56,33.88 48.25,33.57 SIMBLEE.33 | R7.1 3.71,20.19 5.08,21.57 5.08,22.45 DS3231.3 8.91,26.29 v8.94,26.29 | v28.7,17.37 24.05,17.37 21.87,19.56 21.87,21.59 ATMEGA328P.1 | 21.02,22.36 21.02,24.73 20.78,24.97 17.68,24.97 14.73,27.91 v9.02,27.91
  Bottom 0.254: v37.24,25.91 37.16,25.81 30.79,19.46 v28.7,17.37 | v9.02,27.91 9.02,26.39 v8.94,26.29
LEDS
  Top 0.203: 25.5,1.88 PWR.C
  Top 0.254: PWR.C LED2.C LED1.C 22.02,3.14 22.02,8.79 17.6,13.21 17.6,14.58 18.18,15.16 ATMEGA328P.11
N$1
  Top 0.254: R8.1 LED1.A
N$2
  Top 0.254: 38.02,16.07 TC1015.4 38.02,15.71 C5.1
N$3  (via drill 0.33)
  Top 0.203: v22.91,9.22 22.91,8.15 R10.2 | 20.6,21.67 ATMEGA328P.2
  Top 0.254: v21.34,17.53 21.34,20.99 ATMEGA328P.2
  Bottom 0.203: 22.94,9.2 v22.91,9.22 21.34,10.79 v21.34,17.53
N$4
  Top 0.254: R10.1 LED2.A
N$5
  Top 0.254: R3.1 TPS27082.6
N$6
  Top 0.254: D1.A 41.72,7.21 | D1.A R13.1 C13.2 R17.1 | D1.A 41.77,7.21 39.4,7.21 39.17,6.99 37.52,6.99 37.06,7.44 37.06,8.36 36.78,8.64 TRIGGER.2
N$14
  Top 0.254: R15.2 38.25,11.28 39.62,9.91 39.62,8 39.29,7.67 38.43,7.67 TRIGGER.4
N$15
  Top 0.254: R16.1 43.34,23.59 44.2,22.73 44.2,21.66 NPN.1
N$16
  Top 0.254: 47.89,5.44 47.89,5.42 R17.2 47.87,5.44 49.1,5.44 49.66,5.99 49.66,17.12 48.97,17.8 43.79,17.8 43.26,18.34 43.26,19.52 NPN.3
N$17
  Top 0.254: R2.2 38.46,30.53 39.67,29.31 43.43,29.31 44.32,30.23 44.32,31.75 SIMBLEE.25
N$38
  Top 0.254: R12.1 PWR.A
PWR-DWN  (via drill 0.33 pad 0.3)
  Top 0.254: v48.39,32.18 48.07,32.57 SIMBLEE.31 | v49.33,29.67 48.92,29.67 45.64,26.39 43.59,26.39 43.26,26.06 R16.2
  Bottom 0.254: v48.39,32.18 48.39,30.63 v49.33,29.67
RESET
  Top 0.254: ATMEGA328P.29 24.91,20.67 25.76,21.51 25.76,21.94 C9.2 27.48,22.3 | R4.1 27.53,22.25 27.48,22.3 | 27.48,22.3
RXI  (via drill 0.33)
  Top 0.203: ATMEGA328P.30 24.33,21.13
  Top 0.254: ATMEGA328P.30 25.2,22.1 25.2,22.84 25.15,22.84 24.31,23.67 24.31,25.2 24.28,25.2 v16.76,32.64
  Bottom 0.254: FTDI-ARDUINO.TXO 9.83,39.32 9.83,34.82 12.01,32.64 v16.76,32.64
RXI-S  (via drill 0.33)
  Top 0.254: v19.18,35.1 19.05,34.98 12.83,34.98 11.2,36.6 FTDI-SIMBLEE.TXO | R2.1 35.97,30.53 35.41,31.09 31.83,31.09 29.97,32.94 19.48,32.94 v19.18,32.64
  Bottom 0.254: v19.18,32.64 v19.18,35.1
SCL  (via drill 0.33)
  Top 0.254: R11.1 v30.73,35.31 29.9,34.47 13.51,34.47 12.61,33.57 DS3231.16 | ATMEGA328P.28 25.54,20.1 25.54,20.23 26.24,20.93 27.28,21.01 30.79,24.49 | 30.79,24.49 v30.73,26.14 32.23,27.58 33.73,27.58 38.58,22.76 42.75,22.76 43.2,22.3 43.2,21.18 43.81,20.57 44.91,20.57 46.71,22.38 BATT-I2C.2 | 30.79,24.49 30.79,23.13 MB85RC128.6 | v45.29,29.69 45.29,30.53 45.82,31.06 SIMBLEE.28
  Bottom 0.254: I2C.4 27.48,38.2 30.28,35.41 v30.73,35.31 30.73,31.62 30.79,31.57 30.68,31.57 30.07,30.96 30.07,30.45 30.73,29.79 v30.73,26.14 | v45.29,29.69 46.74,28.25 46.74,23.98 BATT-I2C.2
SDA  (via drill 0.33)
  Top 0.203: 30.15,21.97 28.88,21.97 27.28,20.37 26.87,20.37 ATMEGA328P.27
  Top 0.254: R9.1 32.23,33.17 | ATMEGA328P.27 | MB85RC128.5 30.15,21.97 30.15,22.76 v30.2,22.81 | DS3231.15 14.81,33.96 31.71,33.96 R9.1 | v46.33,30.4 SIMBLEE.29 | v32.23,32.21 32.23,33.36 R9.1 | v30.02,26.75 31.73,28.45 v32.26,28.45 32.69,28.02 33.96,28.02 38.71,23.27 41.05,23.27 42.19,24.41 47.57,24.41 BATT-I2C.3
  Bottom 0.254: I2C.5 30.02,38.18 31.42,36.78 31.42,34.25 R9.1 32.27,32.25 v32.23,32.21 32.28,32.16 32.28,25.02 30.2,22.94 v30.2,22.81 30.02,22.99 v30.02,26.75 | v46.33,30.4 46.33,29.67 48.11,27.89 48.11,24.94 BATT-I2C.3
TALK  (via drill 0.33)
  Top 0.203: 47.36,34.09 SIMBLEE.34
  Top 0.254: v37.95,25.22 40.01,25.22 42.27,27.48 45.41,27.48 49.76,31.83 49.76,33.78 49.05,34.49 48.51,34.49 48.09,34.07 SIMBLEE.34 | v34.54,21.31 34.47,21.31 28.68,15.52 R6.1 28.1,14.22 ATMEGA328P.23
  Bottom 0.203: 38.02,25.22 v37.95,25.22
  Bottom 0.254: v34.54,21.31 34.57,21.31 34.57,21.84 v37.95,25.22
TXO  (via drill 0.33)
  Top 0.254: 23.77,21.81 ATMEGA328P.31 24.41,22.44 24.41,22.78 23.75,23.44 23.75,24.69 15.11,33.33 v15.09,33.33
  Bottom 0.254: v15.09,33.33 14.61,33.71 12.42,35.89 12.42,39.24 FTDI-ARDUINO.RXI
TXO-S  (via drill 0.33)
  Top 0.254: SIMBLEE.23 43.33,31.77 43.33,31.14 43.1,30.91 40.51,30.91 39.93,31.5 32.05,31.5 30.05,33.5 16.59,33.5 16.46,33.38 v16.13,33.33
  Bottom 0.254: v16.13,33.33 16,35.79 FTDI-SIMBLEE.RXI
VBAT
  Top 0.254: DS3231.14 14.4,31.72 11.86,29.18 5.77,29.18 0.71,24.13 0.71,13.31 8.74,5.28 8.74,2.72 CR1225.PWR@1
VCC  (via drill 0.33, 0.38, 0.6)
  Top 0.203: 25.22,8.15 R12.2 25.58,8.15
  Top 0.254: R6.2 29.95,13.21 30.02,13.28 | SIMBLEE.7 39.94,38.07 C4.1 37.16,35.31 34.09,35.31 | R1.2 35.04,32.44 R9.2 | R4.2 29.87,20.95 30.45,20.37 31.55,20.37 34.34,23.17
  Top 0.406: C7.1 25.63,11.43 | 25.39,8.08 R12.2 | 6.85,25.91 DS3231.2 | 34.09,35.31 R11.2 R9.2 v33.17,33.4 | 37.21,21.51 30.02,14.33 30.02,13.28 30.02,11.18 27.24,8.39 | TC1015.5 36.69,17.39 | 27.24,8.39 26.9,8.05 25.39,8.05 R12.2 | R12.2 25.38,11.35 C7.1 | C7.1 24.89,12.34 24.36,12.34 23.8,12.9 ATMEGA328P.18 23.77,12.98 22.84,13.92 22.84,14.96 ATMEGA328P.6 16.82,20.98 | v33.2,29.39 26.29,29.39 INVERTER.5 25.8,29.56 v25.27,29.03 | C3.1 34.26,25.53 33.88,25.91 v33.2,25.91 32.72,25.43 32.72,24.77 33.36,24.12 MB85RC128.8 34.34,23.17 34.47,23.04 35.69,23.04 37.21,21.51 | 22.89,37.02 R3.2 | TPS27082.4 23.01,37.15 R3.2 | v23.6,36.14 23.19,36.14 22.81,36.52 R3.2 | R14.2 27.24,8.25 27.24,8.39 | C12.1 37.31,21.62 | 37.31,21.62 37.21,21.51 | 37.31,21.62 37.31,21.41 38.12,20.6 38.12,19.4 C6.A | 16.82,20.98 v10.82,26.98 10.74,27.05 7.9,27.05 6.87,26.02 DS3231.2 | DS3231.2 C10.1 5.31,24.38 R5.2 R7.2 | ATMEGA328P.4 19.4,20.68 18.9,21.18 17.02,21.18 16.82,20.98
  Bottom 0.406: v10.82,26.98 10.82,32.13 8.61,34.34 FTDI-SIMBLEE.VCC FTDI-ARDUINO.VCC | v33.2,25.91 v33.2,29.39 33.2,33.4 v33.17,33.4 | v25.27,29.03 25.27,29.62 23.98,30.91 23.98,35.76 v23.6,36.14
  pour Top (no thermals): 36.63,19.91 35.66,18.95 35.66,17.68 36.53,16.81 37.52,16.81 39.85,19.15 39.85,20.07 38.76,21.16 37.87,21.16
VIN
  Top 0.254: TRIGGER.5 37.8,9.58 37.16,10.21 32.05,10.21 31.98,10.13 | 32.77,13.49 C1.1 | R13.2 42.84,5.42 42.65,5.61 41.8,5.61 D1.K 35.95,5.63 31.98,9.6
  Top 0.406: C1.1
  Top 0.61: C1.1 TC1015.1 | 31.98,10.13 31.98,9.6 | 31.98,10.13 31.98,12.7 C1.1 | POWER.3 31.98,10.13
VRAW  (via drill 0.8)
  Top 0.61: VIN.2 45.91,11.45 v45.92,11.43
  Bottom 0.61: POWER.2 34.52,2.72 41.63,9.83 44.91,9.83 45.92,10.85 v45.92,11.43

### Text on the board
tPlace: GRN | BLK | GND | IO | INT | SCL | SDA | Vcc | GND | CTS | VCC | RXI | TXO | DTR | Simblee Top / Arduino Bottom | SDA | SCL | + | GND | + | Power | Off -- On
tNames: V10d | chip@mcclellands.org
bNames: Trail Traffic Counter v10d / 3-2-17
Name: V5a